# EAGLE design Enclosure 100x68 SR04 (EAGLE 9.6.2)
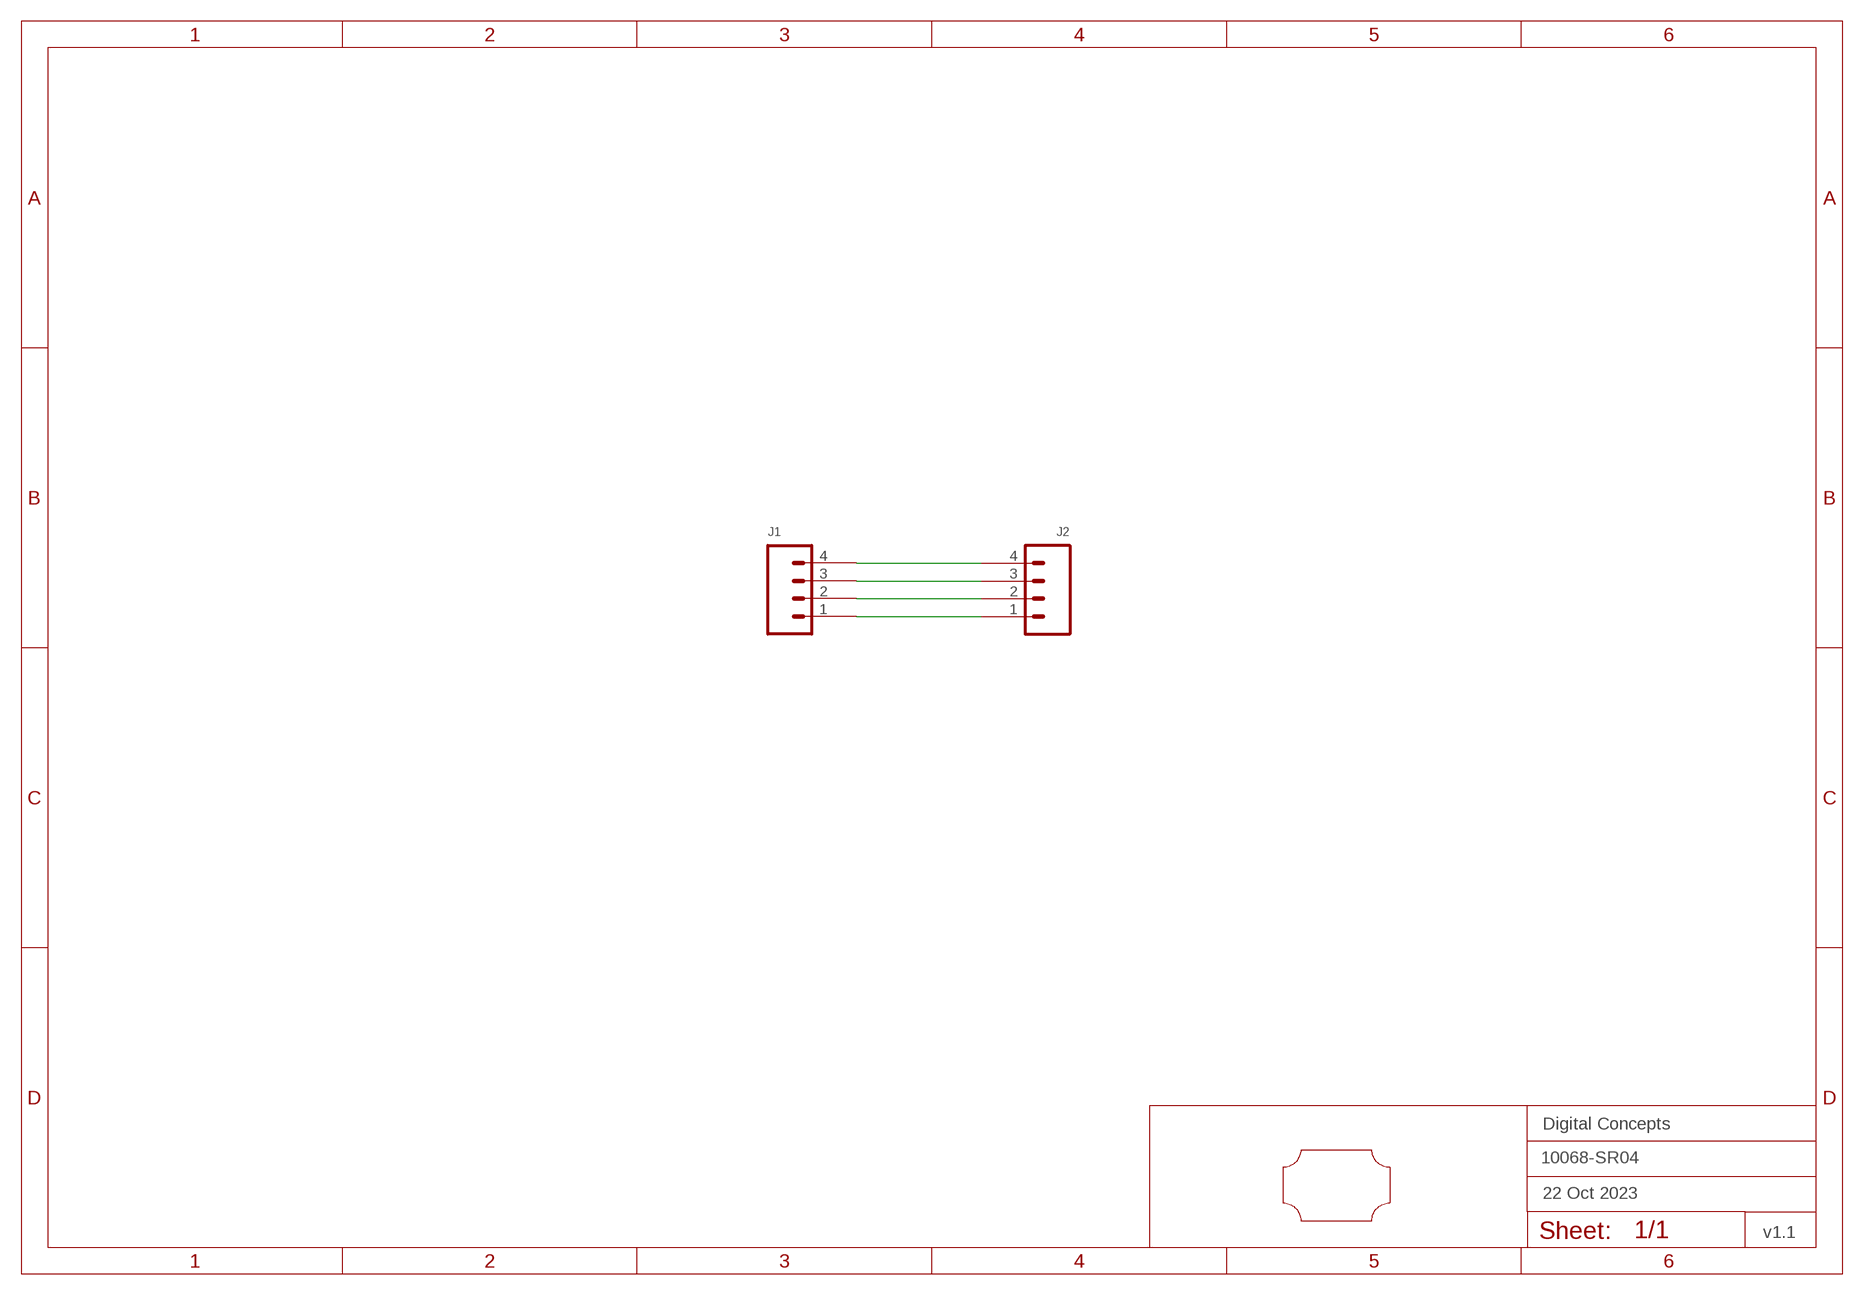
[diagram p0: schematic, sheet 1]
FRAME2 (FRAME-A4L-LOC): DATE: 22 Oct 2023; OWNER: Digital Concepts; TITLE: 10068-SR04; VERSION: v1.1

## Parts
J1  HEADER-1X4-GENERIC  [CONN_04-GENERIC]
J2  JST-XH2.54-4-HORIZONTAL  [JST-XH2.4-4-HORIZONTAL]
U$1  PROTO-34X22-SR04  [PROTO-34X22-SR04]

## Nets
N$1: J1.4 J2.4
N$2: J1.3 J2.3
N$3: J1.2 J2.2
N$4: J1.1 J2.1

## Library data of the parts
J1 = digitalconcepts:HEADER-1X4-GENERIC: Single Row 4-Pin Header
J2 = digitalconcepts:JST-XH2.54-4-HORIZONTAL: XH2.54 4P Horizontal Connector
U$1 = digitalconcepts:PROTO-34X22-SR04: 34 x 22 Prototyping board to fit an 100 x 68 enclosure—AJ-SR04M support

## Board
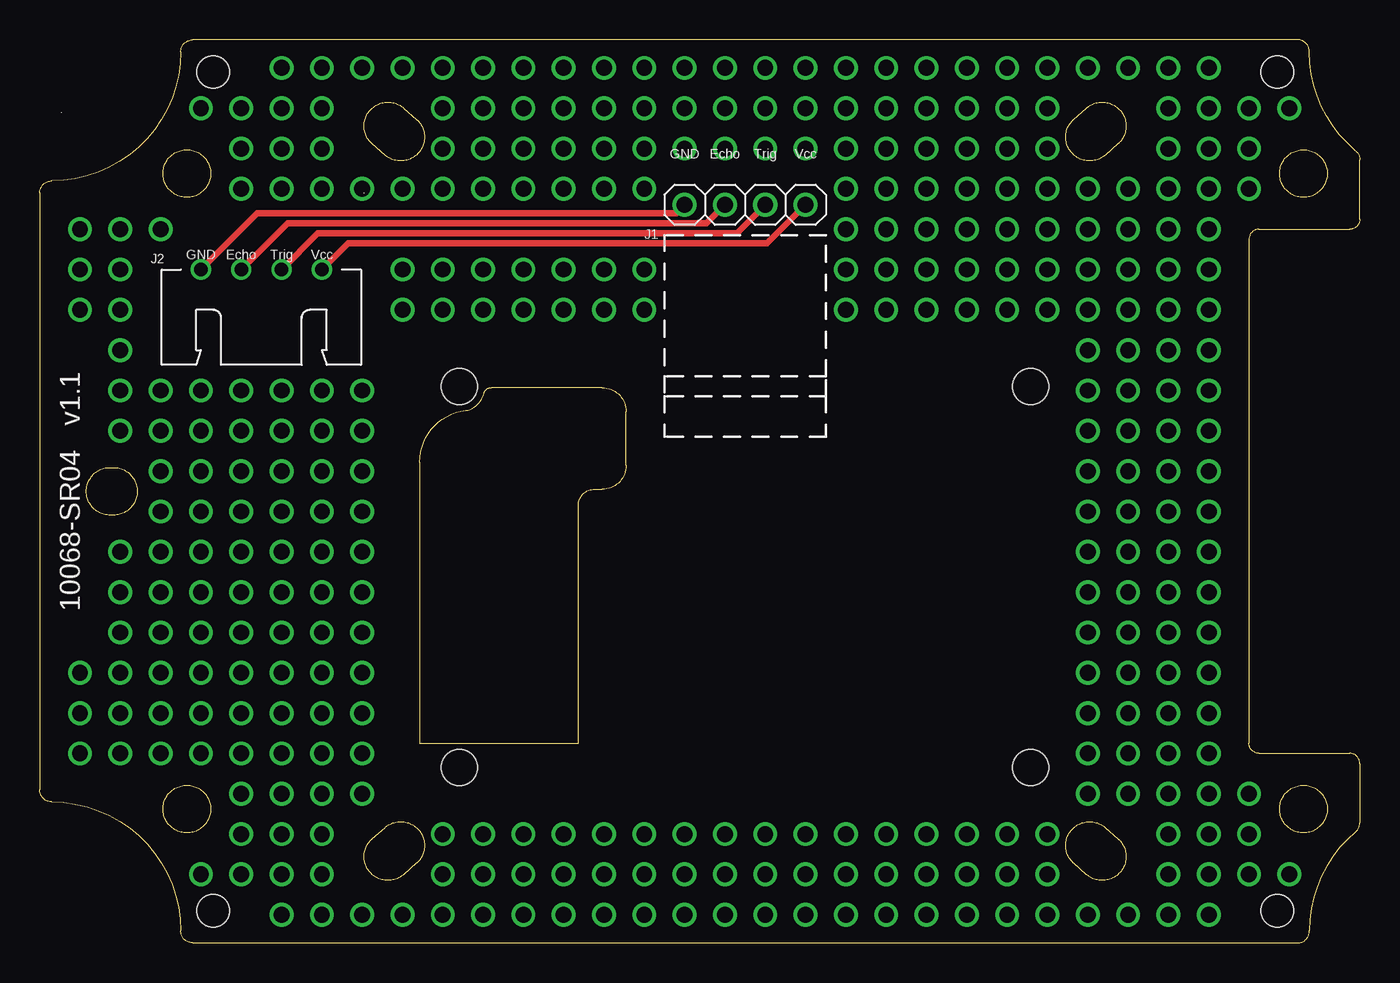
[diagram p1: board, top side]
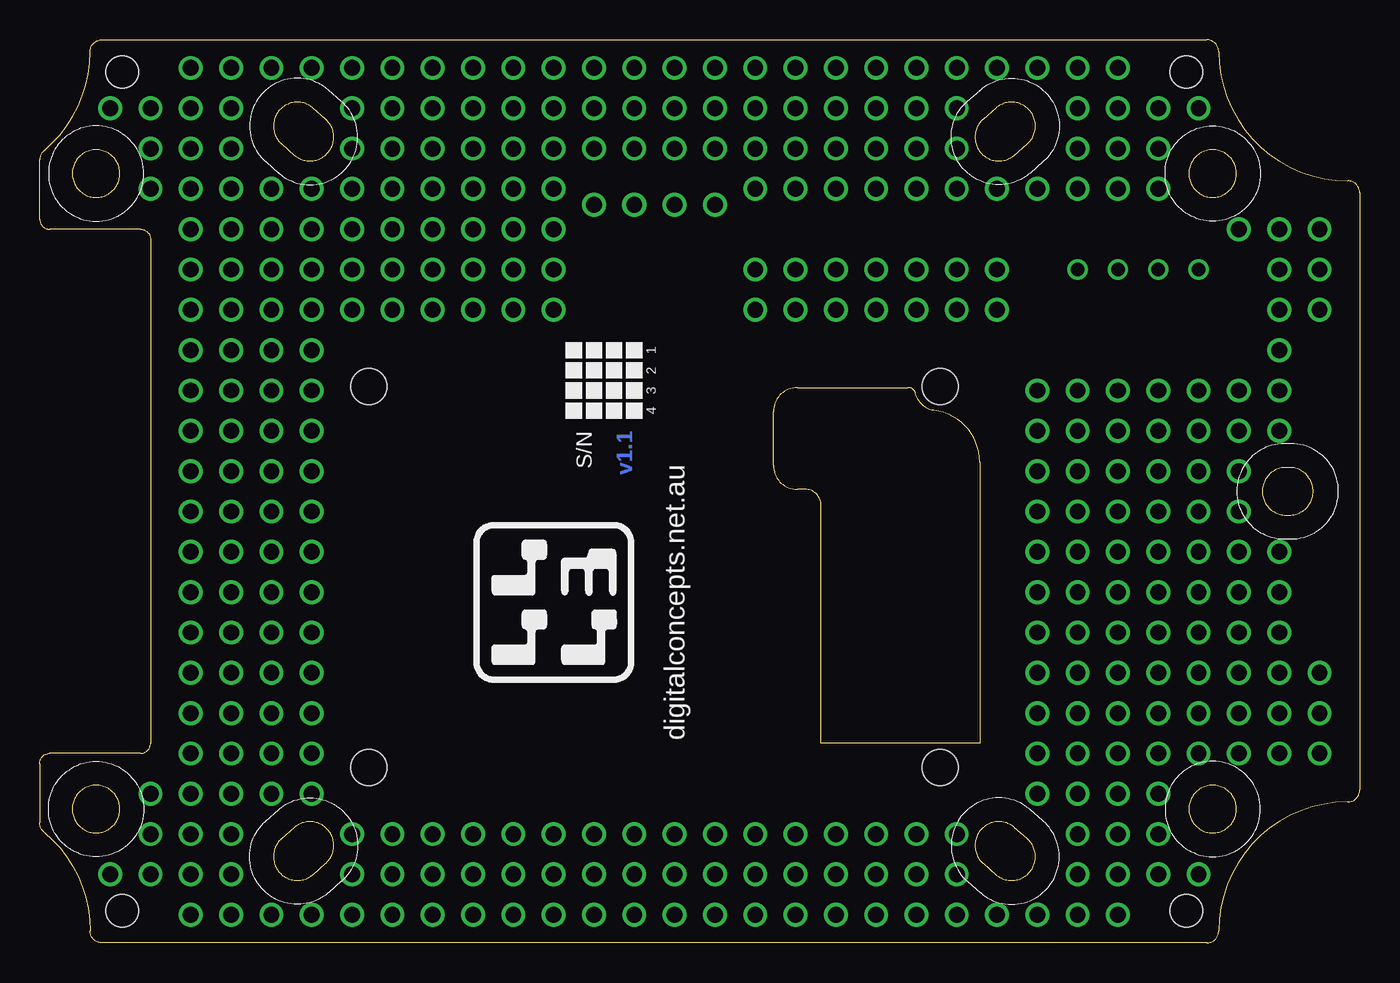
[diagram p2: board, bottom side, seen from below]

Size 83.19 x 56.9 mm. Coordinates in mm from the lower left corner, seen from the top.
Copper layers (1*16): Top 0.035mm / dielectric 1.5mm / Bottom 0.035mm
Design rules "default *": minimum track width 6mil, minimum drill 0.35mm, track to track 6mil, track to pad 6mil, pad to pad 6mil, via to via 6mil, smd to smd 6mil, copper to edge 6mil, drill to drill 6mil, minimum pad ring 1mil, minimum via ring 8mil, stop-mask expansion 4mil, vias tented up to drill 0mil, thermal gap 10mil

### Footprints (pad centres in the part's own frame; a part is rotated, then mirrored left to right if it is on the bottom)
CONN_04-GENERIC = drill 1 pad 1.524: 1 0,0; 2 2.54,0; 3 5.08,0; 4 7.62,0
JST-XH2.4-4-HORIZONTAL = drill 0.85: 1 3.81,0; 2 1.27,0; 3 -1.27,0; 4 -3.81,0
PROTO-34X22-SR04 = drill 1: P01-05 -41.91,-16.51; P01-06 -41.91,-13.97; P01-07 -41.91,-11.43; P01-16 -41.91,11.43; P01-17 -41.91,13.97; P01-18 -41.91,16.51; P02-05 -39.37,-16.51; P02-06 -39.37,-13.97; P02-07 -39.37,-11.43; P02-08 -39.37,-8.89; P02-09 -39.37,-6.35; P02-10 -39.37,-3.81; P02-13 -39.37,3.81; P02-14 -39.37,6.35; P02-15 -39.37,8.89; P02-16 -39.37,11.43; P02-17 -39.37,13.97; P02-18 -39.37,16.51; P03-05 -36.83,-16.51; P03-06 -36.83,-13.97; P03-07 -36.83,-11.43; P03-08 -36.83,-8.89; P03-09 -36.83,-6.35; P03-10 -36.83,-3.81; P03-11 -36.83,-1.27; P03-12 -36.83,1.27; P03-13 -36.83,3.81; P03-14 -36.83,6.35; P03-18 -36.83,16.51; P04-02 -34.29,-24.13; P04-05 -34.29,-16.51; P04-06 -34.29,-13.97; P04-07 -34.29,-11.43; P04-08 -34.29,-8.89; P04-09 -34.29,-6.35; P04-10 -34.29,-3.81; P04-11 -34.29,-1.27; P04-12 -34.29,1.27; P04-13 -34.29,3.81; P04-14 -34.29,6.35; P04-21 -34.29,24.13; P05-02 -31.75,-24.13; P05-03 -31.75,-21.59; P05-04 -31.75,-19.05; P05-05 -31.75,-16.51; P05-06 -31.75,-13.97; P05-07 -31.75,-11.43; P05-08 -31.75,-8.89; P05-09 -31.75,-6.35; P05-10 -31.75,-3.81; P05-11 -31.75,-1.27; P05-12 -31.75,1.27; P05-13 -31.75,3.81; P05-14 -31.75,6.35; P05-19 -31.75,19.05; P05-20 -31.75,21.59; P05-21 -31.75,24.13; P06-01 -29.21,-26.67; P06-02 -29.21,-24.13; P06-03 -29.21,-21.59; P06-04 -29.21,-19.05; P06-05 -29.21,-16.51; P06-06 -29.21,-13.97; P06-07 -29.21,-11.43; P06-08 -29.21,-8.89; P06-09 -29.21,-6.35; P06-10 -29.21,-3.81; P06-11 -29.21,-1.27; P06-12 -29.21,1.27; P06-13 -29.21,3.81; P06-14 -29.21,6.35; P06-19 -29.21,19.05; P06-20 -29.21,21.59; P06-21 -29.21,24.13; P06-22 -29.21,26.67; P07-01 -26.67,-26.67; P07-02 -26.67,-24.13; P07-03 -26.67,-21.59; P07-04 -26.67,-19.05; P07-05 -26.67,-16.51; P07-06 -26.67,-13.97; P07-07 -26.67,-11.43; P07-08 -26.67,-8.89; P07-09 -26.67,-6.35; P07-10 -26.67,-3.81; P07-11 -26.67,-1.27; P07-12 -26.67,1.27; P07-13 -26.67,3.81; P07-14 -26.67,6.35; P07-19 -26.67,19.05; P07-20 -26.67,21.59; P07-21 -26.67,24.13; P07-22 -26.67,26.67; P08-01 -24.13,-26.67; P08-04 -24.13,-19.05; P08-05 -24.13,-16.51; P08-06 -24.13,-13.97; P08-07 -24.13,-11.43; P08-08 -24.13,-8.89; P08-09 -24.13,-6.35; P08-10 -24.13,-3.81; P08-11 -24.13,-1.27; P08-12 -24.13,1.27; P08-13 -24.13,3.81; P08-14 -24.13,6.35; P08-19 -24.13,19.05; P08-22 -24.13,26.67; P09-01 -21.59,-26.67; P09-16 -21.59,11.43; P09-17 -21.59,13.97; P09-19 -21.59,19.05; P09-22 -21.59,26.67; P10-01 -19.05,-26.67; P10-02 -19.05,-24.13; P10-03 -19.05,-21.59; P10-16 -19.05,11.43; P10-17 -19.05,13.97; P10-19 -19.05,19.05; P10-20 -19.05,21.59; P10-21 -19.05,24.13; P10-22 -19.05,26.67; P11-01 -16.51,-26.67; P11-02 -16.51,-24.13; P11-03 -16.51,-21.59; P11-16 -16.51,11.43; P11-17 -16.51,13.97; P11-19 -16.51,19.05; P11-20 -16.51,21.59; P11-21 -16.51,24.13; P11-22 -16.51,26.67; P12-01 -13.97,-26.67; P12-02 -13.97,-24.13; P12-03 -13.97,-21.59; P12-16 -13.97,11.43; P12-17 -13.97,13.97; P12-19 -13.97,19.05; P12-20 -13.97,21.59; P12-21 -13.97,24.13; P12-22 -13.97,26.67; P13-01 -11.43,-26.67; P13-02 -11.43,-24.13; P13-03 -11.43,-21.59; P13-16 -11.43,11.43; P13-17 -11.43,13.97; P13-19 -11.43,19.05; P13-20 -11.43,21.59; P13-21 -11.43,24.13; P13-22 -11.43,26.67; P14-01 -8.89,-26.67; P14-02 -8.89,-24.13; P14-03 -8.89,-21.59; P14-16 -8.89,11.43; P14-17 -8.89,13.97; P14-19 -8.89,19.05; P14-20 -8.89,21.59; P14-21 -8.89,24.13; P14-22 -8.89,26.67; P15-01 -6.35,-26.67; P15-02 -6.35,-24.13; P15-03 -6.35,-21.59; P15-16 -6.35,11.43; P15-17 -6.35,13.97; P15-19 -6.35,19.05; P15-20 -6.35,21.59; P15-21 -6.35,24.13; P15-22 -6.35,26.67; P16-01 -3.81,-26.67; P16-02 -3.81,-24.13; P16-03 -3.81,-21.59; P16-20 -3.81,21.59; P16-21 -3.81,24.13; P16-22 -3.81,26.67; P17-01 -1.27,-26.67; P17-02 -1.27,-24.13; P17-03 -1.27,-21.59; P17-20 -1.27,21.59; P17-21 -1.27,24.13; P17-22 -1.27,26.67; P18-01 1.27,-26.67; P18-02 1.27,-24.13; P18-03 1.27,-21.59; P18-20 1.27,21.59; P18-21 1.27,24.13; P18-22 1.27,26.67; P19-01 3.81,-26.67; P19-02 3.81,-24.13; P19-03 3.81,-21.59; P19-20 3.81,21.59; P19-21 3.81,24.13; P19-22 3.81,26.67; P20-01 6.35,-26.67; P20-02 6.35,-24.13; P20-03 6.35,-21.59; P20-16 6.35,11.43; P20-17 6.35,13.97; P20-18 6.35,16.51; P20-19 6.35,19.05; P20-20 6.35,21.59; P20-21 6.35,24.13; P20-22 6.35,26.67; P21-01 8.89,-26.67; P21-02 8.89,-24.13; P21-03 8.89,-21.59; P21-16 8.89,11.43; P21-17 8.89,13.97; P21-18 8.89,16.51; P21-19 8.89,19.05; P21-20 8.89,21.59; P21-21 8.89,24.13; P21-22 8.89,26.67; P22-01 11.43,-26.67; P22-02 11.43,-24.13; P22-03 11.43,-21.59; P22-16 11.43,11.43; P22-17 11.43,13.97; P22-18 11.43,16.51; P22-19 11.43,19.05; P22-20 11.43,21.59; P22-21 11.43,24.13; P22-22 11.43,26.67; P23-01 13.97,-26.67; P23-02 13.97,-24.13; P23-03 13.97,-21.59; P23-16 13.97,11.43; P23-17 13.97,13.97; P23-18 13.97,16.51; P23-19 13.97,19.05; P23-20 13.97,21.59; P23-21 13.97,24.13; P23-22 13.97,26.67; P24-01 16.51,-26.67; P24-02 16.51,-24.13; P24-03 16.51,-21.59; P24-16 16.51,11.43; P24-17 16.51,13.97; P24-18 16.51,16.51; P24-19 16.51,19.05; P24-20 16.51,21.59; P24-21 16.51,24.13; P24-22 16.51,26.67; P25-01 19.05,-26.67; P25-02 19.05,-24.13; P25-03 19.05,-21.59; P25-16 19.05,11.43; P25-17 19.05,13.97; P25-18 19.05,16.51; P25-19 19.05,19.05; P25-20 19.05,21.59; P25-21 19.05,24.13; P25-22 19.05,26.67; P26-01 21.59,-26.67; P26-04 21.59,-19.05; P26-05 21.59,-16.51; P26-06 21.59,-13.97; P26-07 21.59,-11.43; P26-08 21.59,-8.89; P26-09 21.59,-6.35; P26-10 21.59,-3.81; P26-11 21.59,-1.27; P26-12 21.59,1.27; P26-13 21.59,3.81; P26-14 21.59,6.35; P26-15 21.59,8.89; P26-16 21.59,11.43; P26-17 21.59,13.97; P26-18 21.59,16.51; P26-19 21.59,19.05; P26-22 21.59,26.67; P27-01 24.13,-26.67; P27-04 24.13,-19.05; P27-05 24.13,-16.51; P27-06 24.13,-13.97; P27-07 24.13,-11.43; P27-08 24.13,-8.89; P27-09 24.13,-6.35; P27-10 24.13,-3.81; P27-11 24.13,-1.27; P27-12 24.13,1.27; P27-13 24.13,3.81; P27-14 24.13,6.35; P27-15 24.13,8.89; P27-16 24.13,11.43; P27-17 24.13,13.97; P27-18 24.13,16.51; P27-19 24.13,19.05; P27-22 24.13,26.67; P28-01 26.67,-26.67; P28-02 26.67,-24.13; P28-03 26.67,-21.59; P28-04 26.67,-19.05; P28-05 26.67,-16.51; P28-06 26.67,-13.97; P28-07 26.67,-11.43; P28-08 26.67,-8.89; P28-09 26.67,-6.35; P28-10 26.67,-3.81; P28-11 26.67,-1.27; P28-12 26.67,1.27; P28-13 26.67,3.81; P28-14 26.67,6.35; P28-15 26.67,8.89; P28-16 26.67,11.43; P28-17 26.67,13.97; P28-18 26.67,16.51; P28-19 26.67,19.05; P28-20 26.67,21.59; P28-21 26.67,24.13; P28-22 26.67,26.67; P29-01 29.21,-26.67; P29-02 29.21,-24.13; P29-03 29.21,-21.59; P29-04 29.21,-19.05; P29-05 29.21,-16.51; P29-06 29.21,-13.97; P29-07 29.21,-11.43; P29-08 29.21,-8.89; P29-09 29.21,-6.35; P29-10 29.21,-3.81; P29-11 29.21,-1.27; P29-12 29.21,1.27; P29-13 29.21,3.81; P29-14 29.21,6.35; P29-15 29.21,8.89; P29-16 29.21,11.43; P29-17 29.21,13.97; P29-18 29.21,16.51; P29-19 29.21,19.05; P29-20 29.21,21.59; P29-21 29.21,24.13; P29-22 29.21,26.67; P30-02 31.75,-24.13; P30-03 31.75,-21.59; P30-04 31.75,-19.05; P30-19 31.75,19.05; P30-20 31.75,21.59; P30-21 31.75,24.13; P31-02 34.29,-24.13; P31-21 34.29,24.13 | hole 2.032: -33.528,26.416; 33.528,26.416; 33.528,-26.416; -33.528,-26.416 | hole 2.25: -18,6.6; -18,-17.4; 18,6.6; 18,-17.4

### Placement (x,y rotation side)
J1  40.64,46.5 0 top
J2  13.97,42.42 180 top
U$1  44.45,28.45 0 top

### Tracks (layer width: path | path; a pad name or v marks a point on that pad's centre or on a via)
$X0
  cutout Bottom: 10.92,56.9 arc180 10.92,52.83 arc180
$X1
  cutout Bottom: 77.98,56.9 arc180 77.98,52.83 arc180
$X2
  cutout Bottom: 77.98,4.06 arc180 77.98,0 arc180
$X3
  cutout Bottom: 10.92,4.06 arc180 10.92,0 arc180
$X4
  cutout Top: 10.92,56.9 arc180 10.92,52.83 arc180
$X5
  cutout Top: 77.98,56.9 arc180 77.98,52.83 arc180
$X6
  cutout Top: 77.98,4.06 arc180 77.98,0 arc180
$X7
  cutout Top: 10.92,4.06 arc180 10.92,0 arc180
N$1
  Top 0.406: J2.4 19.43,44.07 45.83,44.07 J1.4
N$2
  Top 0.406: J2.3 17.53,44.7 43.93,44.7 J1.3
N$3
  Top 0.406: J2.2 15.62,45.34 42.02,45.34 J1.2
N$4
  Top 0.406: J2.1 13.72,45.97 40.12,45.97 J1.1

### Text on the board
Bottom: v1.1
tPlace: 10068-SR04 v1.1
bPlace: 1 | 2 | 3 | 4 | S/N | digitalconcepts.net.au
tNames: GND | Echo | Trig | Vcc | GND | Echo | Trig | Vcc